# Altium project 智能车.PrjPcb
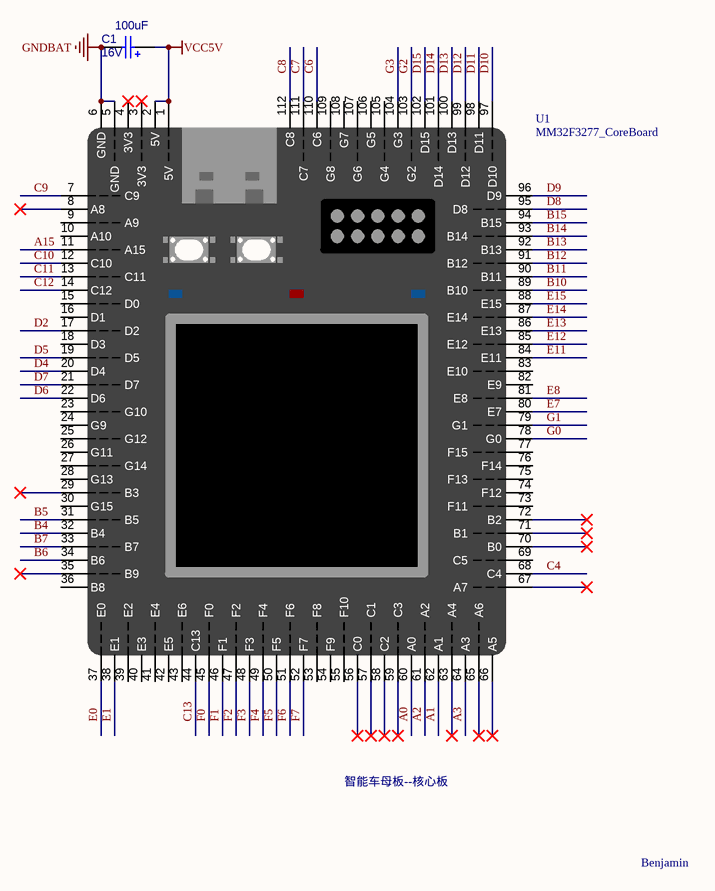
[diagram p0: 核心板.SchDoc]
3 sheets, 104 parts. Net scope: global (net labels, ports and power ports of the same name join across sheets).
Board file: 母板PCB.PcbDoc
Sheets:
  核心板.SchDoc
  模块&电源.SchDoc
  5V电源.SchDoc

## Sheet 核心板.SchDoc
size A4; SheetNumber: 1; SheetTotal: 3

### Parts
C1  value 100uF  Voltage: 16V  [CAPT3528]  (hidden comment: 100uF 16V)
U1  MM32F3277_CoreBoard  [MM32F3277_CoreBoard]

### Nets
GNDBAT: C1.2 U1.5(GND) U1.6(GND)
VCC5V: C1.1 U1.1(5V) U1.2(5V)
A0: U1.60(A0)
A1: U1.62(A1)
A2: U1.61(A2)
A3: U1.64(A3)
A15: U1.11(A15)
B4: U1.32(B4)
B5: U1.31(B5)
B6: U1.34(B6)
B7: U1.33(B7)
B10: U1.89(B10)
B11: U1.90(B11)
B12: U1.91(B12)
B13: U1.92(B13)
B14: U1.93(B14)
B15: U1.94(B15)
C4: U1.68(C4)
C6: U1.110(C6)
C7: U1.111(C7)
C8: U1.112(C8)
C9: U1.7(C9)
C10: U1.12(C10)
C11: U1.13(C11)
C12: U1.14(C12)
C13: U1.44(C13)
D2: U1.17(D2)
D4: U1.20(D4)
D5: U1.19(D5)
D6: U1.22(D6)
D7: U1.21(D7)
D8: U1.95(D8)
D9: U1.96(D9)
D10: U1.97(D10)
D11: U1.98(D11)
D12: U1.99(D12)
D13: U1.100(D13)
D14: U1.101(D14)
D15: U1.102(D15)
E0: U1.37(E0)
E1: U1.38(E1)
E7: U1.80(E7)
E8: U1.81(E8)
E11: U1.84(E11)
E12: U1.85(E12)
E13: U1.86(E13)
E14: U1.87(E14)
E15: U1.88(E15)
F0: U1.45(F0)
F1: U1.46(F1)
F2: U1.47(F2)
F3: U1.48(F3)
F4: U1.49(F4)
F5: U1.50(F5)
F6: U1.51(F6)
F7: U1.52(F7)
G0: U1.78(G0)
G1: U1.79(G1)
G2: U1.103(G2)
G3: U1.104(G3)

Not connected (* = marked no-connect by the designer): U1 3(3V3)* 4(3V3)* 8(A8)* 9(A9) 10(A10) 15(D0) 16(D1) 18(D3) 23(G10) 24(G9) 25(G12) 26(G11) 27(G14) 28(G13) 29(B3)* 30(G15) 35(B9)* 36(B8) 39(E2) 40(E3) 41(E4) 42(E5) 43(E6) 53(F8) 54(F9) 55(F10) 56(C0)* 57(C1)* 58(C2)* 59(C3)* 63(A4)* 65(A6)* 66(A5)* 67(A7)* 69(C5) 70(B0)* 71(B1)* 72(B2)* 73(F11) 74(F12) 75(F13) 76(F14) 77(F15) 82(E9) 83(E10) 105(G4) 106(G5) 107(G6) 108(G7) 109(G8)

### Notes on the sheet
- 智能车母板--核心板
- Benjamin

### Library data of the parts
C1 = Cap-Tan: Tantalum Capacitor; Published: 8-Jun-2000; Revision: July-2002: Re-released for DXP Platform.; Publisher: Altium Limited; Price(RMB): 0.000
U1 = MM32F3277_CoreBoard: 逐飞科技MM32F3277核心板

## Sheet 模块&电源.SchDoc
size A4; SheetNumber: 2; SheetTotal: 3
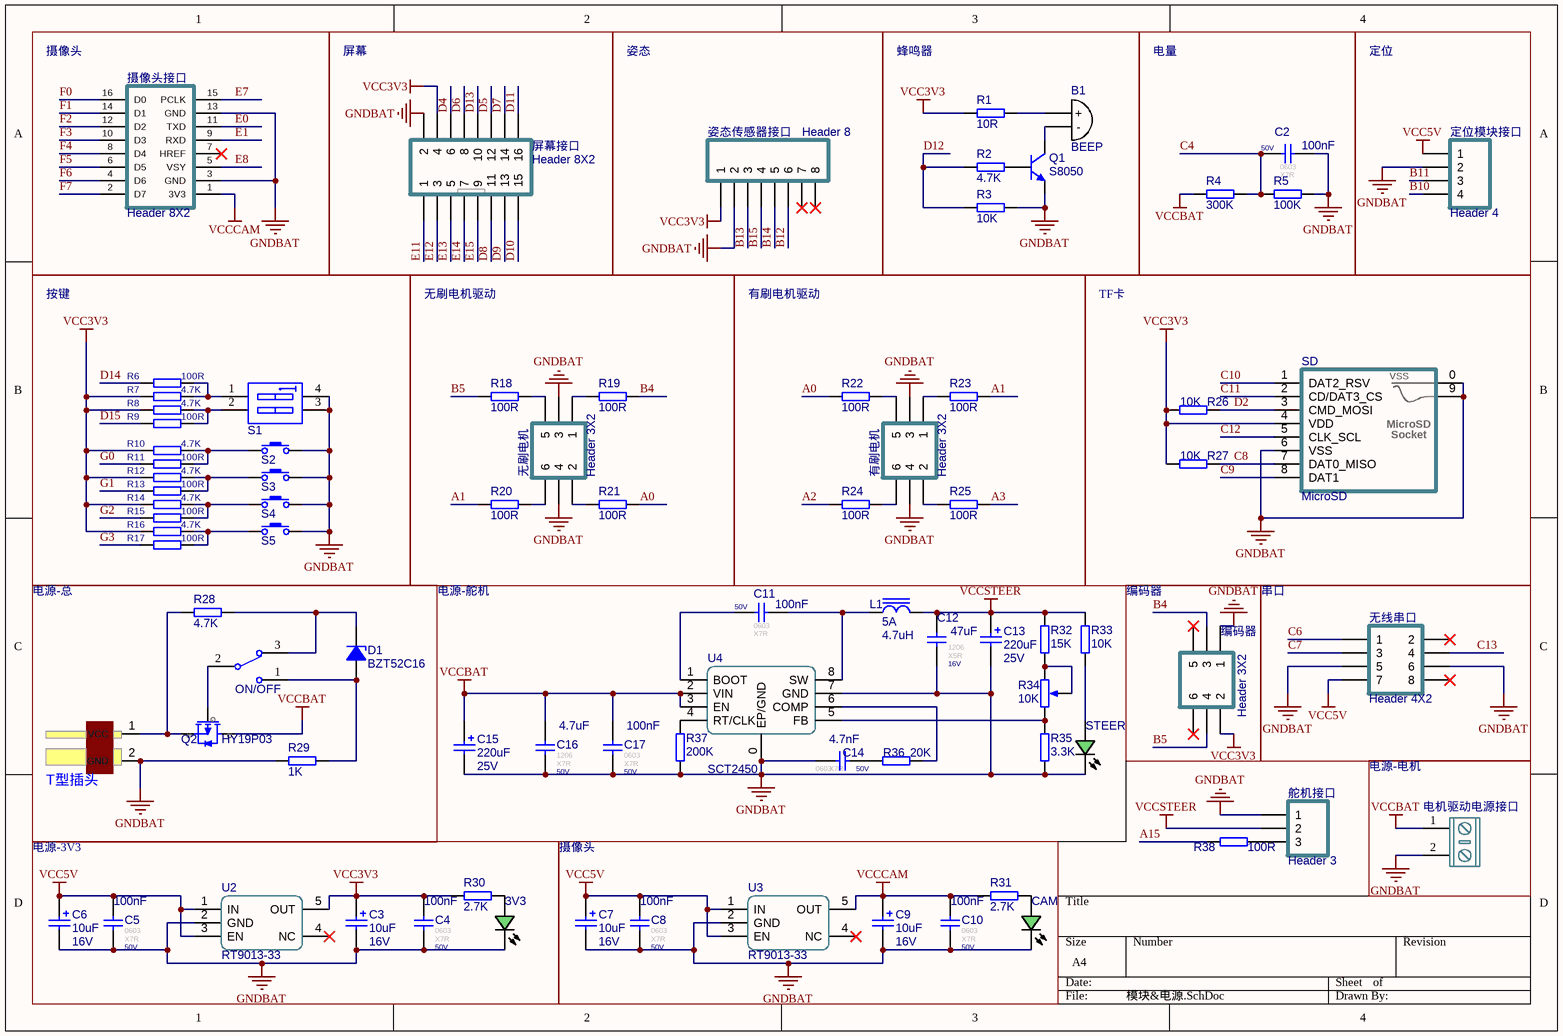
[diagram p1: 模块&电源.SchDoc]

### Parts
3V3  翠绿贴片LED  [LEDC1608(0603)-L]  (value not drawn)
B1  BEEP  [BEEP 9x5.5mm]
C2  value 100nF  Footprint: 0603  Type: X7R  Voltage: 50V  [CAPC3216[1206]S]  (hidden comment: 100nF ±10% 50V)
C3  value 10uF  Voltage: 16V  [CAPT3216]  (hidden comment: 10uF 16V)
C4  value 100nF  Footprint: 0603  Type: X7R  Voltage: 50V  [CAPC3216[1206]S]  (hidden comment: 100nF ±10% 50V)
C5  value 100nF  Footprint: 0603  Type: X7R  Voltage: 50V  [CAPC3216[1206]S]  (hidden comment: 100nF ±10% 50V)
C6  value 10uF  Voltage: 16V  [CAPT3216]  (hidden comment: 10uF 16V)
C7  value 10uF  Voltage: 16V  [CAPT3216]  (hidden comment: 10uF 16V)
C8  value 100nF  Footprint: 0603  Type: X7R  Voltage: 50V  [CAPC3216[1206]S]  (hidden comment: 100nF ±10% 50V)
C9  value 10uF  Voltage: 16V  [CAPT3216]  (hidden comment: 10uF 16V)
C10  value 100nF  Footprint: 0603  Type: X7R  Voltage: 50V  [CAPC3216[1206]S]  (hidden comment: 100nF ±10% 50V)
C11  value 100nF  Footprint: 0603  Type: X7R  Voltage: 50V  [CAPC3216[1206]S]  (hidden comment: 100nF ±10% 50V)
C12  value 47uF  Footprint: 1206  Type: X5R  Voltage: 16V  [CAPC3216[1206]S]  (hidden comment: 47uF ±10% 16V)
C13  value 220uF  Voltage: 25V  [CAPS6.3]  (hidden comment: 220uF 25V)
C14  value 4.7nF  Footprint: 0603  Type: X7R  Voltage: 50V  [CAPC3216[1206]S]  (hidden comment: 4.7nF ±10% 50V)
C15  value 220uF  Voltage: 25V  [CAPS6.3]  (hidden comment: 220uF 25V)
C16  value 4.7uF  Footprint: 1206  Type: X7R  Voltage: 50V  [CAPC3216[1206]S]  (hidden comment: 4.7uF ±10% 50V)
C17  value 100nF  Footprint: 0603  Type: X7R  Voltage: 50V  [CAPC3216[1206]S]  (hidden comment: 100nF ±10% 50V)
CAM  翠绿贴片LED  [LEDC1608(0603)-L]  (value not drawn)
D1  BZT52C16  [SOD-123-L]
DCIN?  T型插头  [Wired T-Header ThroughHole]
L1  value 4.7uH  Imax: 5A  [0630 TPC 7*7*3]  (hidden comment: 4.7uH 5A)
ON/OFF  SW-SPDT  [SS12D10]  (value not drawn)
Q1  S8050  [SOT-23]
Q2  HY19P03  [TO-252AA]
R1  value 10R  [RESC1608[0603]S-N]  (hidden comment: 10R ±1%)
R2  value 4.7K  [RESC1608[0603]S-N]  (hidden comment: 4.7K ±1%)
R3  value 10K  [RESC1608[0603]S-N]  (hidden comment: 10K ±1%)
R4  value 300K  [RESC1608[0603]S-N]  (hidden comment: 300K ±1%)
R5  value 100K  [RESC1608[0603]S-N]  (hidden comment: 100K ±1%)
R6  value 100R  [RESC1608[0603]S-N]  (hidden comment: 100R ±1%)
R7  value 4.7K  [RESC1608[0603]S-N]  (hidden comment: 4.7K ±1%)
R8  value 4.7K  [RESC1608[0603]S-N]  (hidden comment: 4.7K ±1%)
R9  value 100R  [RESC1608[0603]S-N]  (hidden comment: 100R ±1%)
R10  value 4.7K  [RESC1608[0603]S-N]  (hidden comment: 4.7K ±1%)
R11  value 100R  [RESC1608[0603]S-N]  (hidden comment: 100R ±1%)
R12  value 4.7K  [RESC1608[0603]S-N]  (hidden comment: 4.7K ±1%)
R13  value 100R  [RESC1608[0603]S-N]  (hidden comment: 100R ±1%)
R14  value 4.7K  [RESC1608[0603]S-N]  (hidden comment: 4.7K ±1%)
R15  value 100R  [RESC1608[0603]S-N]  (hidden comment: 100R ±1%)
R16  value 4.7K  [RESC1608[0603]S-N]  (hidden comment: 4.7K ±1%)
R17  value 100R  [RESC1608[0603]S-N]  (hidden comment: 100R ±1%)
R18  value 100R  [RESC1608[0603]S-N]  (hidden comment: 100R ±1%)
R19  value 100R  [RESC1608[0603]S-N]  (hidden comment: 100R ±1%)
R20  value 100R  [RESC1608[0603]S-N]  (hidden comment: 100R ±1%)
R21  value 100R  [RESC1608[0603]S-N]  (hidden comment: 100R ±1%)
R22  value 100R  [RESC1608[0603]S-N]  (hidden comment: 100R ±1%)
R23  value 100R  [RESC1608[0603]S-N]  (hidden comment: 100R ±1%)
R24  value 100R  [RESC1608[0603]S-N]  (hidden comment: 100R ±1%)
R25  value 100R  [RESC1608[0603]S-N]  (hidden comment: 100R ±1%)
R26  value 10K  [RESC1608[0603]S-N]  (hidden comment: 10K ±1%)
R27  value 10K  [RESC1608[0603]S-N]  (hidden comment: 10K ±1%)
R28  value 4.7K  [RESC1608[0603]S-N]  (hidden comment: 4.7K ±1%)
R29  value 1K  [RESC1608[0603]S-N]  (hidden comment: 1K ±1%)
R30  value 2.7K  [RESC1608[0603]S-N]  (hidden comment: 2.7K ±1%)
R31  value 2.7K  [RESC1608[0603]S-N]  (hidden comment: 2.7K ±1%)
R32  value 15K  [RESC1608[0603]S-N]  (hidden comment: 15K ±1%)
R33  value 10K  [RESC1608[0603]S-N]  (hidden comment: 10K ±1%)
R34  10K  [RESPOT3296]
R35  value 3.3K  [RESC1608[0603]S-N]  (hidden comment: 3.3K ±1%)
R36  value 20K  [RESC1608[0603]S-N]  (hidden comment: 20K ±1%)
R37  value 200K  [RESC1608[0603]S-N]  (hidden comment: 200K ±1%)
R38  value 100R  [RESC1608[0603]S-N]  (hidden comment: 100R ±1%)
S1  SW DIP-2  [Code SW-2-DIP-2.54]  (value not drawn)
S2  Button  [PTS810-3*4-CurvePin]  (value not drawn)
S3  Button  [PTS810-3*4-CurvePin]  (value not drawn)
S4  Button  [PTS810-3*4-CurvePin]  (value not drawn)
S5  Button  [PTS810-3*4-CurvePin]  (value not drawn)
SD  MicroSD  [TF-001]
STEER  翠绿贴片LED  [LEDC1608(0603)-L]  (value not drawn)
U2  RT9013-33  [SOT-23-5]
U3  RT9013-33  [SOT-23-5]
U4  SCT2450  [SOP-8E]
姿态传感器接口  Header 8  [HDR1X8]
定位模块接口  Header 4  [HDR1X4]
屏幕接口  Header 8X2  [HDR2X8-F-High]
摄像头接口  Header 8X2  [Cam_HDR2X8-F-SMT]
无刷电机  Header 3X2  [HDR2X3-M-SMT]
无线串口  Header 4X2  [HDR2X4-F-SMT]
有刷电机  Header 3X2  [HDR2X3-M-SMT]
电机驱动电源接口  KF/WJ/DG 30x connecter  [KF/WJ/DG 301-2p-5.0mm]  (value not drawn)
编码器  Header 3X2  [HDR2X3-M-SMT]
舵机接口  Header 3  [HDR1X3]

### Blocks framed on the sheet
摄像头: 摄像头接口
屏幕: 屏幕接口
姿态: 姿态传感器接口
蜂鸣器: B1 Q1 R1-R3
电量: C2 R4 R5
定位: 定位模块接口
按键: R6-R17 S1-S5
无刷电机驱动: R18-R21 无刷电机
有刷电机驱动: R22-R25 有刷电机
TF卡: R26 R27 SD
电源-总: D1 DCIN? ON/OFF Q2 R28 R29
编码器: 编码器
串口: 无线串口
电源-电机: 电机驱动电源接口
电源-3V3: 3V3 C3-C6 R30 U2
摄像头: C7-C10 CAM R31 U3

### Nets
GNDBAT: 3V3.C C2.2 C3.2 C4.2 C5.2 C6.2 C7.2 C8.2 C9.2 C10.2 C12.1 C13.2 C14.1 C15.2 C16.1 C17.1 CAM.C DCIN?.2(GND) Q1.2(E) R3.2 R5.2 R29.1 R35.2 R37.1 S1.3(B2) S1.4(B1) S2.1 S3.1 S4.1 S5.1 SD.0(GND) SD.6(VSS) SD.9 STEER.C U2.2(GND) U3.2(GND) U4.0(EP/GND) U4.7(GND) 姿态传感器接口.2 定位模块接口.2 屏幕接口.2 摄像头接口.3(GND) 摄像头接口.13(GND) 无刷电机.3 无刷电机.4 无线串口.5 无线串口.6 有刷电机.3 有刷电机.4 电机驱动电源接口.2 编码器.1 舵机接口.1
VCC3V3: C3.1 C4.1 R1.1 R7.1 R8.1 R10.1 R12.1 R14.1 R16.1 R26.1 R27.1 R30.1 SD.4(VDD) U2.5(OUT) 姿态传感器接口.1 屏幕接口.4 编码器.2
VCC5V: C5.1 C6.1 C7.1 C8.1 U2.1(IN) U2.3(EN) U3.1(IN) U3.3(EN) 定位模块接口.1 无线串口.7
VCCBAT: C15.1 C16.2 C17.2 Q2.1(D) R4.1 U4.2(VIN) U4.3(EN) 电机驱动电源接口.1
VCCCAM: C9.1 C10.1 R31.1 U3.5(OUT) 摄像头接口.1(3V3)
VCCSTEER: C12.2 C13.1 L1.2 R32.1 R33.1 舵机接口.2
A0: R21.2 R22.1
A1: R20.1 R23.2
A2: R24.1
A3: R25.2
A15: R38.1
B4: R19.2 编码器.3
B5: R18.1 编码器.4
B10: 定位模块接口.4
B11: 定位模块接口.3
B12: 姿态传感器接口.6
B13: 姿态传感器接口.3
B14: 姿态传感器接口.5
B15: 姿态传感器接口.4
C4: C2.1 R4.2 R5.1
C6: 无线串口.1
C7: 无线串口.3
C8: R27.2 SD.7(DAT0_MISO)
C9: SD.8(DAT1)
C10: SD.1(DAT2_RSV)
C11: SD.2(CD/DAT3_CS)
C12: SD.5(CLK_SCL)
C13: 无线串口.4
D2: R26.2 SD.3(CMD_MOSI)
D4: 屏幕接口.6
D5: 屏幕接口.12
D6: 屏幕接口.8
D7: 屏幕接口.14
D8: 屏幕接口.11
D9: 屏幕接口.13
D10: 屏幕接口.15
D11: 屏幕接口.16
D12: R2.1 R3.1
D13: 屏幕接口.10
D14: R6.1
D15: R9.1
E0: 摄像头接口.11(TXD)
E1: 摄像头接口.9(RXD)
E7: 摄像头接口.15(PCLK)
E8: 摄像头接口.5(VSY)
E11: 屏幕接口.1
E12: 屏幕接口.3
E13: 屏幕接口.5
E14: 屏幕接口.7
E15: 屏幕接口.9
F0: 摄像头接口.16(D0)
F1: 摄像头接口.14(D1)
F2: 摄像头接口.12(D2)
F3: 摄像头接口.10(D3)
F4: 摄像头接口.8(D4)
F5: 摄像头接口.6(D5)
F6: 摄像头接口.4(D6)
F7: 摄像头接口.2(D7)
G0: R11.1
G1: R13.1
G2: R15.1
G3: R17.1
Net3V3_A: 3V3.A R30.2
NetB1_1: B1.1(+) R1.2
NetB1_2: B1.2(-) Q1.3(C)
NetC11_1: C11.1 U4.1(BOOT)
NetC11_2: C11.2 L1.1 U4.8(SW)
NetC14_2: C14.2 R36.1
NetCAM_A: CAM.A R31.2
NetD1_A: D1.A ON/OFF.1 R29.2
NetD1_K: D1.K ON/OFF.3 R28.1
NetDCIN?_1: DCIN?.1(VCC) Q2.3(S) R28.2
NetON/OFF_2: ON/OFF.2 Q2.2(G)
NetQ1_1: Q1.1(B) R2.2
NetR6_2: R6.2 R7.2 S1.1(A1)
NetR8_2: R8.2 R9.2 S1.2(A2)
NetR10_2: R10.2 R11.2 S2.2
NetR12_2: R12.2 R13.2 S3.2
NetR14_2: R14.2 R15.2 S4.2
NetR16_2: R16.2 R17.2 S5.2
NetR18_2: R18.2 无刷电机.5
NetR19_1: R19.1 无刷电机.1
NetR20_2: R20.2 无刷电机.6
NetR21_1: R21.1 无刷电机.2
NetR22_2: R22.2 有刷电机.5
NetR23_1: R23.1 有刷电机.1
NetR24_2: R24.2 有刷电机.6
NetR25_1: R25.1 有刷电机.2
NetR32_2: R32.2 R34.2(BOT) R34.ADJ
NetR33_2: R33.2 STEER.A
NetR34_1: R34.1(TOP) R35.1 U4.5(FB)
NetR36_2: R36.2 U4.6(COMP)
NetR37_2: R37.2 U4.4(RT/CLK)
NetR38_2: R38.2 舵机接口.3

Not connected (* = marked no-connect by the designer): U2 4(NC)*; U3 4(NC)*; 姿态传感器接口 7* 8*; 摄像头接口 7(HREF)*; 无线串口 2* 8*; 编码器 5* 6*

### Notes on the sheet
- 电源-舵机
- (in symbol MicroSD_TF001A) Socket

### Library data of the parts
3V3 CAM STEER = LED Chip Green: Published: 8-Jun-2000; Revision: July-2002: Re-released for DXP Platform.; Publisher: Altium Limited; Price(RMB): 0.00
B1 = BEEP: 蜂鸣器
C2 C4 C5 C8 C10 C11 C17 = Cap-Chip_2: 贴片电容; Published: 2021-12-13; Revision: V1.2; Tolerance: ±10%
C3 C6 C7 C9 = Cap-Tan_1: Tantalum Capacitor; Published: 8-Jun-2000; Revision: July-2002: Re-released for DXP Platform.; Publisher: Altium Limited; Price(RMB): 0.000
C12 = Cap-Chip_1: 贴片电容; Published: 2021-12-13; Revision: V1.2; Tolerance: ±10%
C13 C15 = Cap-Solid: Polarized Capacitor (Radial); Published: 8-Jun-2000; Revision: July-2002: Re-released for DXP Platform.; Publisher: Altium Limited; Price(RMB): 0.000
C14 = Cap-Chip: 贴片电容; Published: 2021-12-13; Revision: V1.2; Tolerance: ±10%
C16 = Cap-Chip_3: 贴片电容; Published: 2021-12-13; Revision: V1.2; Tolerance: ±10%
D1 = Diode Zen: 稳压二极管 齐纳二极管  Zener Diode; Published: 8-Jun-2000; Revision: July-2002: Re-released for DXP Platform.; Publisher: Altium Limited; Price(RMB): 0.000
DCIN? = T_Header
L1 = Ind-Power: 功率电感; DCR: .5m; Published: 8-Jun-2000; Revision: July-2002: Re-released for DXP Platform.; Publisher: Altium Limited; Price(RMB): 0.000
ON/OFF = SW-SPDT: 单刀双掷开关 3脚船型、钮子、拨动开关 SPDT Subminiature Toggle Switch; Published: 24-Mar-1999; Publisher: Altium Limited; Price(RMB): 0.000
Q1 = NPN S8050: Discrete NPN Bipolar Transistor; Published: 8-Jun-2000; Revision: July-2002: Re-released for DXP Platform.; Publisher: Altium Limited; Price(RMB): 0.000; PartNumber: S8050
Q2 = HY19P03: HY19P03 P-Channel MOSFET
R1 = Res-Chip_13: 贴片电阻; Published: 8-Jun-2000; Revision: July-2002: Re-released for DXP Platform.; Tolerance: ±1%
R2 R7 R8 R10 R12 R14 R16 R28 = Res-Chip_5: 贴片电阻; Published: 8-Jun-2000; Revision: July-2002: Re-released for DXP Platform.; Tolerance: ±1%
R3 R26 R27 R33 = Res-Chip_3: 贴片电阻; Published: 8-Jun-2000; Revision: July-2002: Re-released for DXP Platform.; Tolerance: ±1%
R4 = Res-Chip_11: 贴片电阻; Published: 8-Jun-2000; Revision: July-2002: Re-released for DXP Platform.; Tolerance: ±1%
R5 = Res-Chip_12: 贴片电阻; Published: 8-Jun-2000; Revision: July-2002: Re-released for DXP Platform.; Tolerance: ±1%
R6 R9 R11 R13 R15 R17-R25 R38 = Res-Chip_8: 贴片电阻; Published: 8-Jun-2000; Revision: July-2002: Re-released for DXP Platform.; Tolerance: ±1%
R29 = Res-Chip_10: 贴片电阻; Published: 8-Jun-2000; Revision: July-2002: Re-released for DXP Platform.; Tolerance: ±1%
R30 R31 = Res-Chip_9: 贴片电阻; Published: 8-Jun-2000; Revision: July-2002: Re-released for DXP Platform.; Tolerance: ±1%
R32 = Res-Chip_6: 贴片电阻; Published: 8-Jun-2000; Revision: July-2002: Re-released for DXP Platform.; Tolerance: ±1%
R34 = Res-Adj-3p: 可调电阻; Value: 10K
R35 = Res-Chip_7: 贴片电阻; Published: 8-Jun-2000; Revision: July-2002: Re-released for DXP Platform.; Tolerance: ±1%
R36 = Res-Chip_1: 贴片电阻; Published: 8-Jun-2000; Revision: July-2002: Re-released for DXP Platform.; Tolerance: ±1%
R37 = Res-Chip: 贴片电阻; Published: 8-Jun-2000; Revision: July-2002: Re-released for DXP Platform.; Tolerance: ±1%
S1 = Code SW-2: 2位拨码开关; Published: 24-Mar-1999; Revision: July-2002: Re-released for DXP Platform.; Publisher: Altium Limited; Price(RMB): 0.000
S2-S5 = KEY: 按键; Published: 24-Mar-1999; Publisher: Altium Limited; Price(RMB): 0.000
SD = MicroSD_TF001A: 星坤 KXTF-001
U2 U3 = RT9013-33: 3.3V 500mA SOT-23-5 LDO
U4 = SCT2450: 3.8V-36V Vin, 5A, High Efficiency Synchronous Step-down DCDC Converter / with Programmable Frequency
姿态传感器接口 = Header 8: Header, 8-Pin; LatestRevisionDate: 17-Jul-2002; LatestRevisionNote: Re-released for DXP Platform.; Publisher: Altium Limited; Price(RMB): 0.00
定位模块接口 = Header 4: Header, 4-Pin; LatestRevisionDate: 17-Jul-2002; LatestRevisionNote: Re-released for DXP Platform.; Publisher: Altium Limited; Price(RMB): 0.00
屏幕接口 = Header 8X2: Header, 8-Pin, Dual row; LatestRevisionDate: 17-Jul-2002; LatestRevisionNote: Re-released for DXP Platform.; Publisher: Altium Limited; Price(RMB): 0.00
摄像头接口 = Camera Interface: 摄像头转接板接口 2x8 双排座; LatestRevisionDate: 17-Jul-2002; LatestRevisionNote: Re-released for DXP Platform.; Publisher: Altium Limited; Price(RMB): 0.00
无刷电机 有刷电机 编码器 = Header 3X2: Header, 3-Pin, Dual row; LatestRevisionDate: 17-Jul-2002; LatestRevisionNote: Re-released for DXP Platform.; Publisher: Altium Limited; Price(RMB): 0.00
无线串口 = Header 4X2: Header, 4-Pin, Dual row; LatestRevisionDate: 17-Jul-2002; LatestRevisionNote: Re-released for DXP Platform.; Publisher: Altium Limited; Price(RMB): 0.00
电机驱动电源接口 = KF/WJ/DG 30x: 接线端子 2Pin
舵机接口 = Header 3: Header, 3-Pin; LatestRevisionDate: 17-Jul-2002; LatestRevisionNote: Re-released for DXP Platform.; Publisher: Altium Limited; Price(RMB): 0.00

## Sheet 5V电源.SchDoc
size A4; SheetNumber: 3; SheetTotal: 3
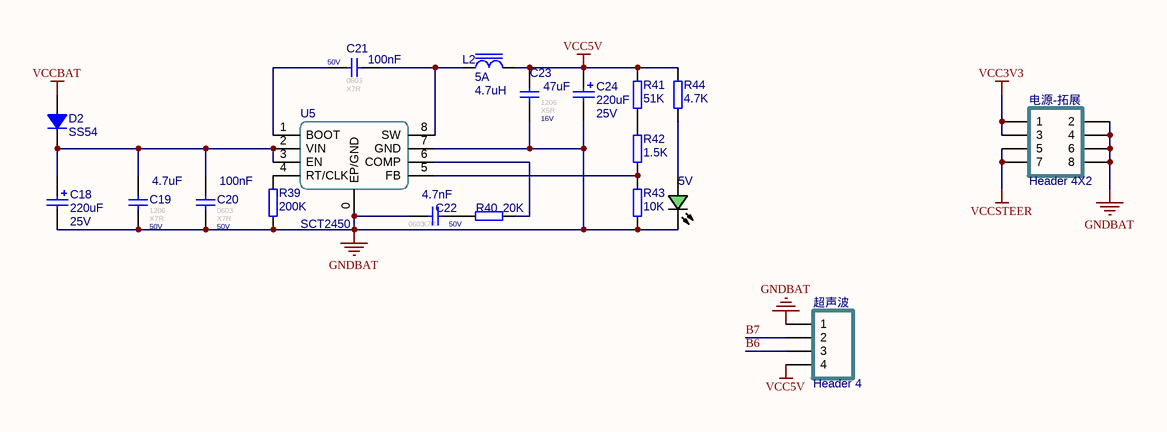
[diagram p2: 5V电源.SchDoc]

### Parts
5V  翠绿贴片LED  [LEDC1608(0603)-L]  (value not drawn)
C18  value 220uF  Voltage: 25V  [CAPS6.3]  (hidden comment: 220uF 25V)
C19  value 4.7uF  Footprint: 1206  Type: X7R  Voltage: 50V  [CAPC3216[1206]S]  (hidden comment: 4.7uF ±10% 50V)
C20  value 100nF  Footprint: 0603  Type: X7R  Voltage: 50V  [CAPC3216[1206]S]  (hidden comment: 100nF ±10% 50V)
C21  value 100nF  Footprint: 0603  Type: X7R  Voltage: 50V  [CAPC3216[1206]S]  (hidden comment: 100nF ±10% 50V)
C22  value 4.7nF  Footprint: 0603  Type: X7R  Voltage: 50V  [CAPC3216[1206]S]  (hidden comment: 4.7nF ±10% 50V)
C23  value 47uF  Footprint: 1206  Type: X5R  Voltage: 16V  [CAPC3216[1206]S]  (hidden comment: 47uF ±10% 16V)
C24  value 220uF  Voltage: 25V  [CAPS6.3]  (hidden comment: 220uF 25V)
D2  SS54  [SMA[DO-214AC]]
L2  value 4.7uH  Imax: 5A  [0630 TPC 7*7*3]  (hidden comment: 4.7uH 5A)
R39  value 200K  [RESC1608[0603]S-N]  (hidden comment: 200K ±1%)
R40  value 20K  [RESC1608[0603]S-N]  (hidden comment: 20K ±1%)
R41  value 51K  [RESC1608[0603]S-N]  (hidden comment: 51K ±1%)
R42  value 1.5K  [RESC1608[0603]S-N]  (hidden comment: 1.5K ±1%)
R43  value 10K  [RESC1608[0603]S-N]  (hidden comment: 10K ±1%)
R44  value 4.7K  [RESC1608[0603]S-N]  (hidden comment: 4.7K ±1%)
U5  SCT2450  [SOP-8E]
电源-拓展  Header 4X2  [HDR2X4-F-SMT]
超声波  Header 4  [HDR1X4]

### Nets
GNDBAT: 5V.C C18.2 C19.1 C20.1 C22.1 C23.1 C24.2 R39.1 R43.2 U5.0(EP/GND) U5.7(GND) 电源-拓展.2 电源-拓展.4 电源-拓展.6 电源-拓展.8 超声波.1
VCC3V3: 电源-拓展.1 电源-拓展.3
VCC5V: C23.2 C24.1 L2.2 R41.1 R44.1 超声波.4
VCCBAT: D2.A
VCCSTEER: 电源-拓展.5 电源-拓展.7
B6: 超声波.3
B7: 超声波.2
Net5V_A: 5V.A R44.2
NetC18_1: C18.1 C19.2 C20.2 D2.K U5.2(VIN) U5.3(EN)
NetC21_1: C21.1 U5.1(BOOT)
NetC21_2: C21.2 L2.1 U5.8(SW)
NetC22_2: C22.2 R40.1
NetR39_2: R39.2 U5.4(RT/CLK)
NetR40_2: R40.2 U5.6(COMP)
NetR41_2: R41.2 R42.1
NetR42_2: R42.2 R43.1 U5.5(FB)

### Library data of the parts
5V = LED Chip Green: Published: 8-Jun-2000; Revision: July-2002: Re-released for DXP Platform.; Publisher: Altium Limited; Price(RMB): 0.00
C18 C24 = Cap-Solid: Polarized Capacitor (Radial); Published: 8-Jun-2000; Revision: July-2002: Re-released for DXP Platform.; Publisher: Altium Limited; Price(RMB): 0.000
C19 = Cap-Chip_3: 贴片电容; Published: 2021-12-13; Revision: V1.2; Tolerance: ±10%
C20 C21 = Cap-Chip_2: 贴片电容; Published: 2021-12-13; Revision: V1.2; Tolerance: ±10%
C22 = Cap-Chip: 贴片电容; Published: 2021-12-13; Revision: V1.2; Tolerance: ±10%
C23 = Cap-Chip_1: 贴片电容; Published: 2021-12-13; Revision: V1.2; Tolerance: ±10%
D2 = Diode: 普通二极管 Diode; Imax: 500mA; Published: 8-Jun-2000; Revision: July-2002: Re-released for DXP Platform.; Publisher: Altium Limited; Price(RMB): 0.000
L2 = Ind-Power: 功率电感; DCR: .5m; Published: 8-Jun-2000; Revision: July-2002: Re-released for DXP Platform.; Publisher: Altium Limited; Price(RMB): 0.000
R39 = Res-Chip: 贴片电阻; Published: 8-Jun-2000; Revision: July-2002: Re-released for DXP Platform.; Tolerance: ±1%
R40 = Res-Chip_1: 贴片电阻; Published: 8-Jun-2000; Revision: July-2002: Re-released for DXP Platform.; Tolerance: ±1%
R41 = Res-Chip_2: 贴片电阻; Published: 8-Jun-2000; Revision: July-2002: Re-released for DXP Platform.; Tolerance: ±1%
R42 = Res-Chip_4: 贴片电阻; Published: 8-Jun-2000; Revision: July-2002: Re-released for DXP Platform.; Tolerance: ±1%
R43 = Res-Chip_3: 贴片电阻; Published: 8-Jun-2000; Revision: July-2002: Re-released for DXP Platform.; Tolerance: ±1%
R44 = Res-Chip_5: 贴片电阻; Published: 8-Jun-2000; Revision: July-2002: Re-released for DXP Platform.; Tolerance: ±1%
U5 = SCT2450: as U4 on sheet 模块&电源
电源-拓展 = Header 4X2: Header, 4-Pin, Dual row; LatestRevisionDate: 17-Jul-2002; LatestRevisionNote: Re-released for DXP Platform.; Publisher: Altium Limited; Price(RMB): 0.00
超声波 = Header 4: Header, 4-Pin; LatestRevisionDate: 17-Jul-2002; LatestRevisionNote: Re-released for DXP Platform.; Publisher: Altium Limited; Price(RMB): 0.00

## Nets that join several sheets
GNDBAT: 核心板 (C1.2 U1.5 U1.6), 模块&电源 (52 pins), 5V电源 (16 pins)
VCC3V3: 模块&电源 (17 pins), 5V电源 (电源-拓展.1 电源-拓展.3)
VCC5V: 核心板 (C1.1 U1.1 U1.2), 模块&电源 (10 pins), 5V电源 (6 pins)
VCCBAT: 模块&电源 (8 pins), 5V电源 (D2.A)
VCCSTEER: 模块&电源 (6 pins), 5V电源 (电源-拓展.5 电源-拓展.7)
A0: 核心板 (U1.60), 模块&电源 (R21.2 R22.1)
A1: 核心板 (U1.62), 模块&电源 (R20.1 R23.2)
A2: 核心板 (U1.61), 模块&电源 (R24.1)
A3: 核心板 (U1.64), 模块&电源 (R25.2)
A15: 核心板 (U1.11), 模块&电源 (R38.1)
B4: 核心板 (U1.32), 模块&电源 (R19.2 编码器.3)
B5: 核心板 (U1.31), 模块&电源 (R18.1 编码器.4)
B6: 核心板 (U1.34), 5V电源 (超声波.3)
B7: 核心板 (U1.33), 5V电源 (超声波.2)
B10: 核心板 (U1.89), 模块&电源 (定位模块接口.4)
B11: 核心板 (U1.90), 模块&电源 (定位模块接口.3)
B12: 核心板 (U1.91), 模块&电源 (姿态传感器接口.6)
B13: 核心板 (U1.92), 模块&电源 (姿态传感器接口.3)
B14: 核心板 (U1.93), 模块&电源 (姿态传感器接口.5)
B15: 核心板 (U1.94), 模块&电源 (姿态传感器接口.4)
C4: 核心板 (U1.68), 模块&电源 (C2.1 R4.2 R5.1)
C6: 核心板 (U1.110), 模块&电源 (无线串口.1)
C7: 核心板 (U1.111), 模块&电源 (无线串口.3)
C8: 核心板 (U1.112), 模块&电源 (R27.2 SD.7)
C9: 核心板 (U1.7), 模块&电源 (SD.8)
C10: 核心板 (U1.12), 模块&电源 (SD.1)
C11: 核心板 (U1.13), 模块&电源 (SD.2)
C12: 核心板 (U1.14), 模块&电源 (SD.5)
C13: 核心板 (U1.44), 模块&电源 (无线串口.4)
D2: 核心板 (U1.17), 模块&电源 (R26.2 SD.3)
D4: 核心板 (U1.20), 模块&电源 (屏幕接口.6)
D5: 核心板 (U1.19), 模块&电源 (屏幕接口.12)
D6: 核心板 (U1.22), 模块&电源 (屏幕接口.8)
D7: 核心板 (U1.21), 模块&电源 (屏幕接口.14)
D8: 核心板 (U1.95), 模块&电源 (屏幕接口.11)
D9: 核心板 (U1.96), 模块&电源 (屏幕接口.13)
D10: 核心板 (U1.97), 模块&电源 (屏幕接口.15)
D11: 核心板 (U1.98), 模块&电源 (屏幕接口.16)
D12: 核心板 (U1.99), 模块&电源 (R2.1 R3.1)
D13: 核心板 (U1.100), 模块&电源 (屏幕接口.10)
D14: 核心板 (U1.101), 模块&电源 (R6.1)
D15: 核心板 (U1.102), 模块&电源 (R9.1)
E0: 核心板 (U1.37), 模块&电源 (摄像头接口.11)
E1: 核心板 (U1.38), 模块&电源 (摄像头接口.9)
E7: 核心板 (U1.80), 模块&电源 (摄像头接口.15)
E8: 核心板 (U1.81), 模块&电源 (摄像头接口.5)
E11: 核心板 (U1.84), 模块&电源 (屏幕接口.1)
E12: 核心板 (U1.85), 模块&电源 (屏幕接口.3)
E13: 核心板 (U1.86), 模块&电源 (屏幕接口.5)
E14: 核心板 (U1.87), 模块&电源 (屏幕接口.7)
E15: 核心板 (U1.88), 模块&电源 (屏幕接口.9)
F0: 核心板 (U1.45), 模块&电源 (摄像头接口.16)
F1: 核心板 (U1.46), 模块&电源 (摄像头接口.14)
F2: 核心板 (U1.47), 模块&电源 (摄像头接口.12)
F3: 核心板 (U1.48), 模块&电源 (摄像头接口.10)
F4: 核心板 (U1.49), 模块&电源 (摄像头接口.8)
F5: 核心板 (U1.50), 模块&电源 (摄像头接口.6)
F6: 核心板 (U1.51), 模块&电源 (摄像头接口.4)
F7: 核心板 (U1.52), 模块&电源 (摄像头接口.2)
G0: 核心板 (U1.78), 模块&电源 (R11.1)
G1: 核心板 (U1.79), 模块&电源 (R13.1)
G2: 核心板 (U1.103), 模块&电源 (R15.1)
G3: 核心板 (U1.104), 模块&电源 (R17.1)